# EAGLE design LTC_PowerStation (EAGLE 7.2.0)
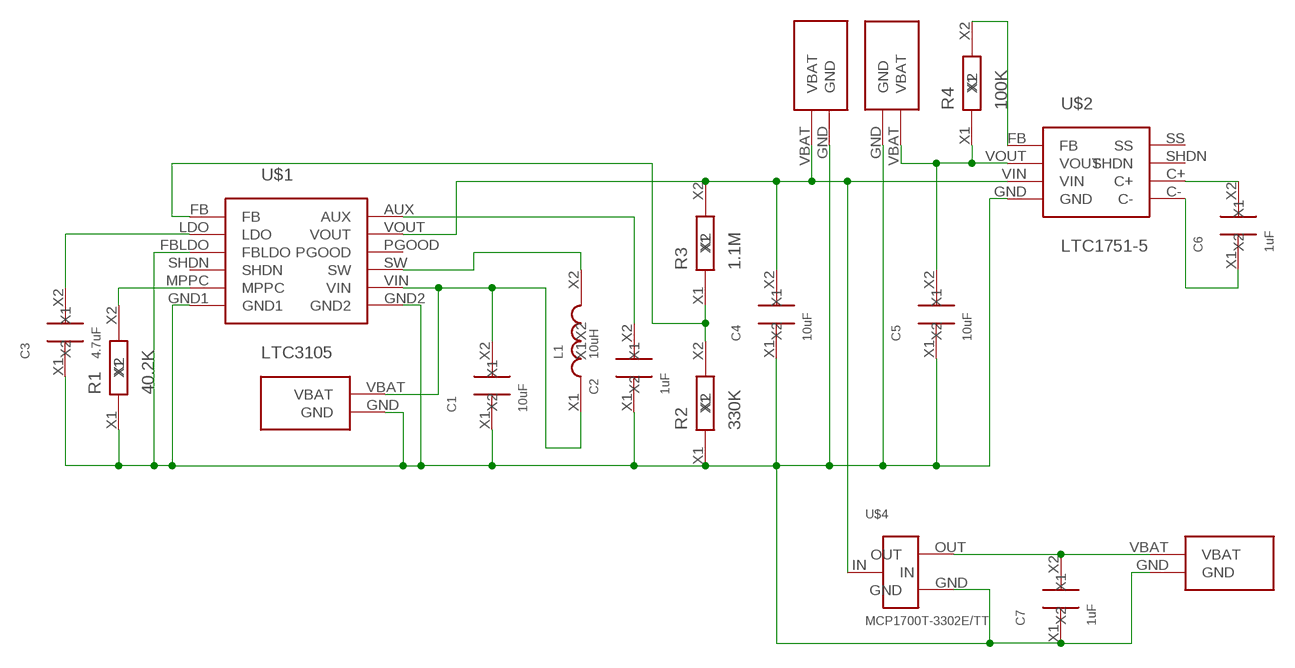
[diagram p0: schematic, sheet 1]

## Parts
C1  10uF  C_SMD_2.1X1.25  [SMD_2.1X1.25]
C2  1uF  C_SMD_2.1X1.25  [SMD_2.1X1.25]
C3  4.7uF  C_SMD_2.1X1.25  [SMD_2.1X1.25]
C4  10uF  C_SMD_2.1X1.25  [SMD_2.1X1.25]
C5  10uF  C_SMD_2.1X1.25  [SMD_2.1X1.25]
C6  1uF  C_SMD_2.1X1.25  [SMD_2.1X1.25]
C7  1uF  C_SMD_2.1X1.25  [SMD_2.1X1.25]
L1  10uH  L_SMD_2.1X1.25  [SMD_2.1X1.25]
R1  40.2K  R_SMD_2.1X1.25  [SMD_2.1X1.25]
R2  330K  R_SMD_2.1X1.25  [SMD_2.1X1.25]
R3  1.1M  R_SMD_2.1X1.25  [SMD_2.1X1.25]
R4  100K  R_SMD_2.1X1.25  [SMD_2.1X1.25]
U$1  LTC3105  [LTC3105]
U$2  LTC1751-5  [LTC1751-5]
U$3  BAT_PLUG  [BAT_PLUG]
U$4  MCP1700T-3302E/TT  [MCP1700T-3302E/TT]
U$5  BAT_PLUG  [BAT_PLUG]
U$10  BAT_PLUG  [BAT_PLUG]
U$11  BAT_PLUG  [BAT_PLUG]

## Nets
N$1: C1.X1 C2.X1 C3.X1 C4.X1 C5.X1 C7.X1 R1.X1 R2.X1 U$1.FBLDO U$1.GND1 U$1.GND2 U$2.GND U$3.GND U$4.GND U$5.GND U$10.GND U$11.GND
N$2: C3.X2 U$1.LDO
N$3: R1.X2 U$1.MPPC
N$4: C2.X2 U$1.AUX
N$5: L1.X2 U$1.SW
N$6: R2.X2 R3.X1 U$1.FB
N$7: C4.X2 R3.X2 U$1.VOUT U$2.VIN U$4.IN U$11.VBAT
N$8: C5.X2 R4.X1 U$2.VOUT U$3.VBAT
N$10: C1.X2 L1.X1 U$1.VIN U$10.VBAT
N$12: R4.X2 U$2.FB
N$14: C6.X2 U$2.C+
N$15: C6.X1 U$2.C-
N$16: C7.X2 U$4.OUT U$5.VBAT
Unconnected: U$1.PGOOD U$1.SHDN U$2.SHDN U$2.SS

## Library data of the parts
C1-C7 = MyPowerComponents:C_SMD_2.1X1.25
L1 = MyPowerComponents:L_SMD_2.1X1.25
R1-R4 = MyPowerComponents:R_SMD_2.1X1.25
U$1 = MyDuino:LTC3105
U$2 = MyPowerComponents:LTC1751-5
U$3 U$5 U$10 U$11 = MyDuino:BAT_PLUG
U$4 = MyDuino:MCP1700T-3302E/TT

## Board
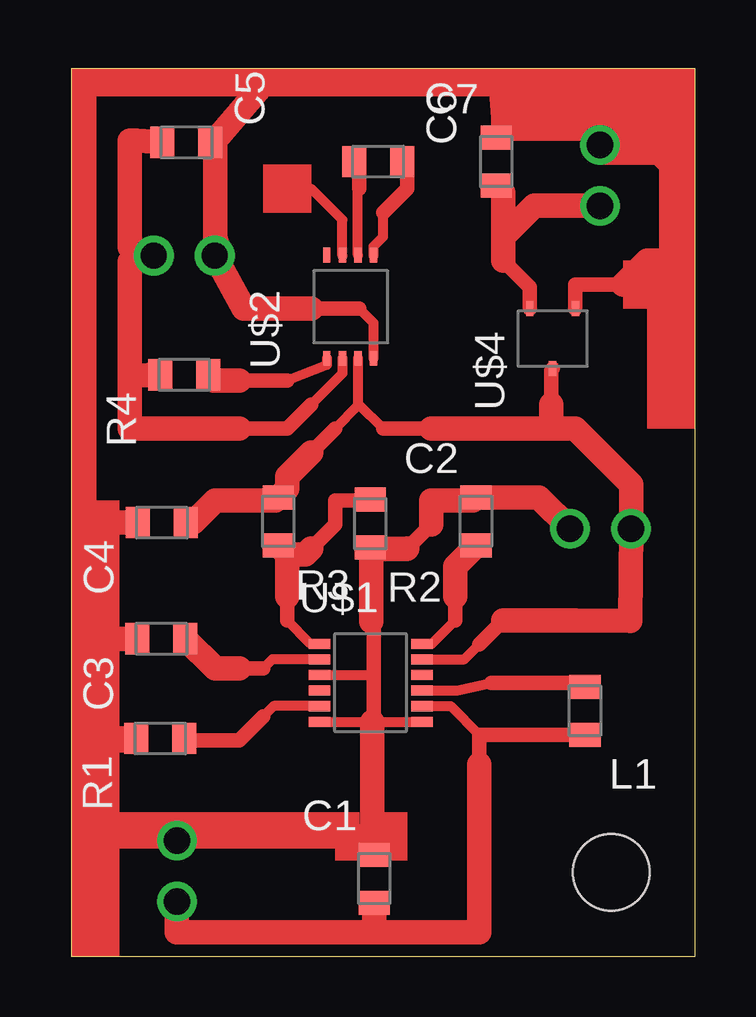
[diagram p1: board, top side]

Size 26 x 37 mm. Coordinates in mm from the lower left corner, seen from the top.
Outline: 0,0 26,0 26,37 0,37 0,0
Copper layers (1*16): Top 0.035mm / dielectric 1.5mm / Bottom 0.035mm
Design rules "default": minimum track width 10mil, minimum drill 24mil, track to track 8mil, track to pad 8mil, pad to pad 8mil, via to via 8mil, smd to smd 8mil, copper to edge 40mil, drill to drill 8mil, minimum pad ring 10mil, minimum via ring 8mil, stop-mask expansion 4mil, vias tented up to drill 0mil, thermal gap 10mil
Holes 3.2 mm at 22.5,3.5

### Footprints (pad centres in the part's own frame; a part is rotated, then mirrored left to right if it is on the bottom)
SMD_2.1X1.25 = smd 1.3 x 1: X1 0,1; X2 0,-1
LTC3105 = smd 0.89 x 0.42: AUX 3.82,1.95; FB -0.45,1.95; FBLDO -0.45,0.65; GND1 -0.45,-1.3; GND2 3.82,-1.3; LDO -0.45,1.3; MPPC -0.45,-0.65; PGOOD 3.82,0.65; SHDN -0.45,0; SW 3.82,0; VIN 3.82,-0.65; VOUT 3.82,1.3
LTC1751-5 = smd 0.61 x 0.305: C+ 2.15,0; C- 2.15,-0.65; FB -2.15,1.3; GND -2.15,-0.65; SHDN 2.15,0.65; SS 2.15,1.3; VIN -2.15,0; VOUT -2.15,0.65
BAT_PLUG = drill 1.1: GND 0,0; VBAT 0,2.54
MCP1700T-3302E/TT = smd 0.61 x 0.305: GND 1.25,-0.95; IN -1.25,0; OUT 1.25,0.95

### Placement (x,y rotation side)
C1  12.63,3.24 0 top
C2  16.87,18.13 0 top
C3  3.76,13.24 90 top
C4  3.78,18.08 90 top
C5  4.8,33.93 270 top
C6  12.79,33.13 270 top
C7  17.71,33.13 0 top
L1  21.41,10.24 180 top
R1  3.71,9.08 90 top
R2  12.46,18.04 180 top
R3  8.63,18.13 180 top
R4  4.71,24.24 90 top
U$1  10.79,11.08 0 top
U$2  11.95,27.08 90 top
U$3  5.98,29.21 90 top
U$4  20.06,25.75 90 top
U$5  22.03,33.83 180 top
U$10  4.41,4.83 180 top
U$11  20.79,17.83 270 top

### Tracks (layer width: path | path; a pad name or v marks a point on that pad's centre or on a via)
N$1
  Top 0.406: U$1.GND1 12.55,9.78 | 12.55,9.78 U$1.GND2 | U$1.FBLDO 12.55,11.73 | 12.55,11.73 12.55,9.78 | 12.5,13.95 12.55,14 12.55,11.73 | U$2.GND 12.6,26.4 12,27 7,27 7,28 6,29 6,34
  Top 0.61: 14,17 15,18 | 23,28 21,28 U$4.GND | 12,27 10,27
  Top 1.016: C1.X1 12.55,4.32 12.55,5 | 12.55,5 12.55,9.78 | R2.X1 12.5,16.99 | 12.5,16.99 12.5,13.95 | 0.55,18.08 C4.X1 1.08,18.08 1,18 | 0.55,18.08 1,18 | 1,18 1,13.24 | 1,13.24 1,9.08 | C3.X1 1,13.24 | 1,9 2.71,9 R1.X1 1,9.08 | 4.41,5 1,5 1,9 | 4.41,5 U$10.GND | 1,9.08 1,9 | 4.41,5 12.55,5 | 12.5,16.99 13.99,16.99 14,17 | 15,18 15,19 16.74,19 C2.X1 19.49,19.13 U$11.GND | 8,36.35 5.93,33.93 C5.X1 5.87,34 6,34 6,30 6.21,29.21 U$3.GND 7.19,27 10,27 | 8,36.35 17.9,36.35 | C7.X1 18,34.42 18,35 17.9,36.35 | 17.9,36.35 21,36 22,35 22,33.86 U$5.GND 24.17,33.83 25,33 25,29 24,29 23,28 | 0.55,18.08 0.55,36.35 8,36.35
N$2
  Top 0.406: U$1.LDO 8.38,12.38 8,12
  Top 0.61: 8,12 7,12
  Top 1.016: 7,12 6,12 C3.X2
N$3
  Top 0.406: U$1.MPPC 8.43,10.43 8,10
  Top 0.61: 8,10 7,9 4.79,9 R1.X2
N$4
  Top 0.406: U$1.AUX 15.03,13.03 16,14
  Top 0.61: 16,14 16,15
  Top 1.016: 16,15 16,16.26 C2.X2
N$5
  Top 0.406: U$1.SW 16.08,11.08 17.5,11.4
  Top 0.61: 17.5,11.4 20.8,11.4 L1.X2
N$6
  Top 0.406: U$1.FB 9.97,13.03 9,14
  Top 0.61: 9,14 9,15 | 10,17 11,18 11,19 12.42,19 R2.X2
  Top 1.016: 9,15 9,16.76 | 9,16.76 R3.X1 | 9,16.76 9.76,16.76 10,17
N$7
  Top 0.406: U$1.VOUT 16.38,12.38 17,13 | 11,22 11.95,22.95 U$2.VIN 11.95,23.05 13,22
  Top 0.61: 17,13 18,14 | 11,22 10,21 | 13,22 15,22 | 20,23 20,24.44 U$4.IN
  Top 1.016: 18,14 21,14 23.3,13.98 U$11.VBAT 23.33,19.67 21,22 20,22 | C4.X2 5.08,18.08 6,19 8.5,19 R3.X2 9,19.5 9,20 10,21 | 15,22 20,22 | 20,22 20,23
N$8
  Top 0.406: U$2.VOUT 11.3,24.3 10,23
  Top 0.61: 10,23 9,22 7,22
  Top 1.016: 7,22 2.45,22 2.45,24.2 | 2.45,24.2 2.45,28.97 U$3.VBAT 2.44,29.56 2.45,30 2.45,34 2.73,34 C5.X2 | R4.X1 3.24,24.24 2.45,24.2
N$9
  Top 0.406: 11.3,29.2 11.3,30.7
N$10
  Top 0.406: U$1.VIN 15.81,10.43 17,9.24
  Top 0.61: L1.X1 17,9.24 17,8
  Top 1.016: U$10.VBAT 4.4,1 12.63,1 | 12.63,1 C1.X2 | 17,8 17,1 12.63,1
N$11
  Top 0.406: 11.3,30.7 10,32 9,32
N$12
  Top 0.406: U$2.FB 10.65,24.65 9,24
  Top 0.61: 9,24 7,24
  Top 1.016: 7,24 5.95,24 R4.X2
N$13
  Top 0.61: 12.6,9.9 12.6,13.9
N$14
  Top 0.406: U$2.C+ 11.95,31.95 12,32
  Top 0.61: 12,32 12,32.92 C6.X2
N$15
  Top 0.406: U$2.C- 12.6,29.6 13,30 13,31
  Top 0.61: 13,31 14,32 14,32.92 C6.X1
N$16
  Top 0.61: U$4.OUT 19.11,27.89 18,29
  Top 1.016: 18,29 18,30 | 18,30 18,31.84 C7.X2 | U$5.VBAT 19.29,31.29 18,30
(copper drawn outside any net)
  shapes: Top area x14